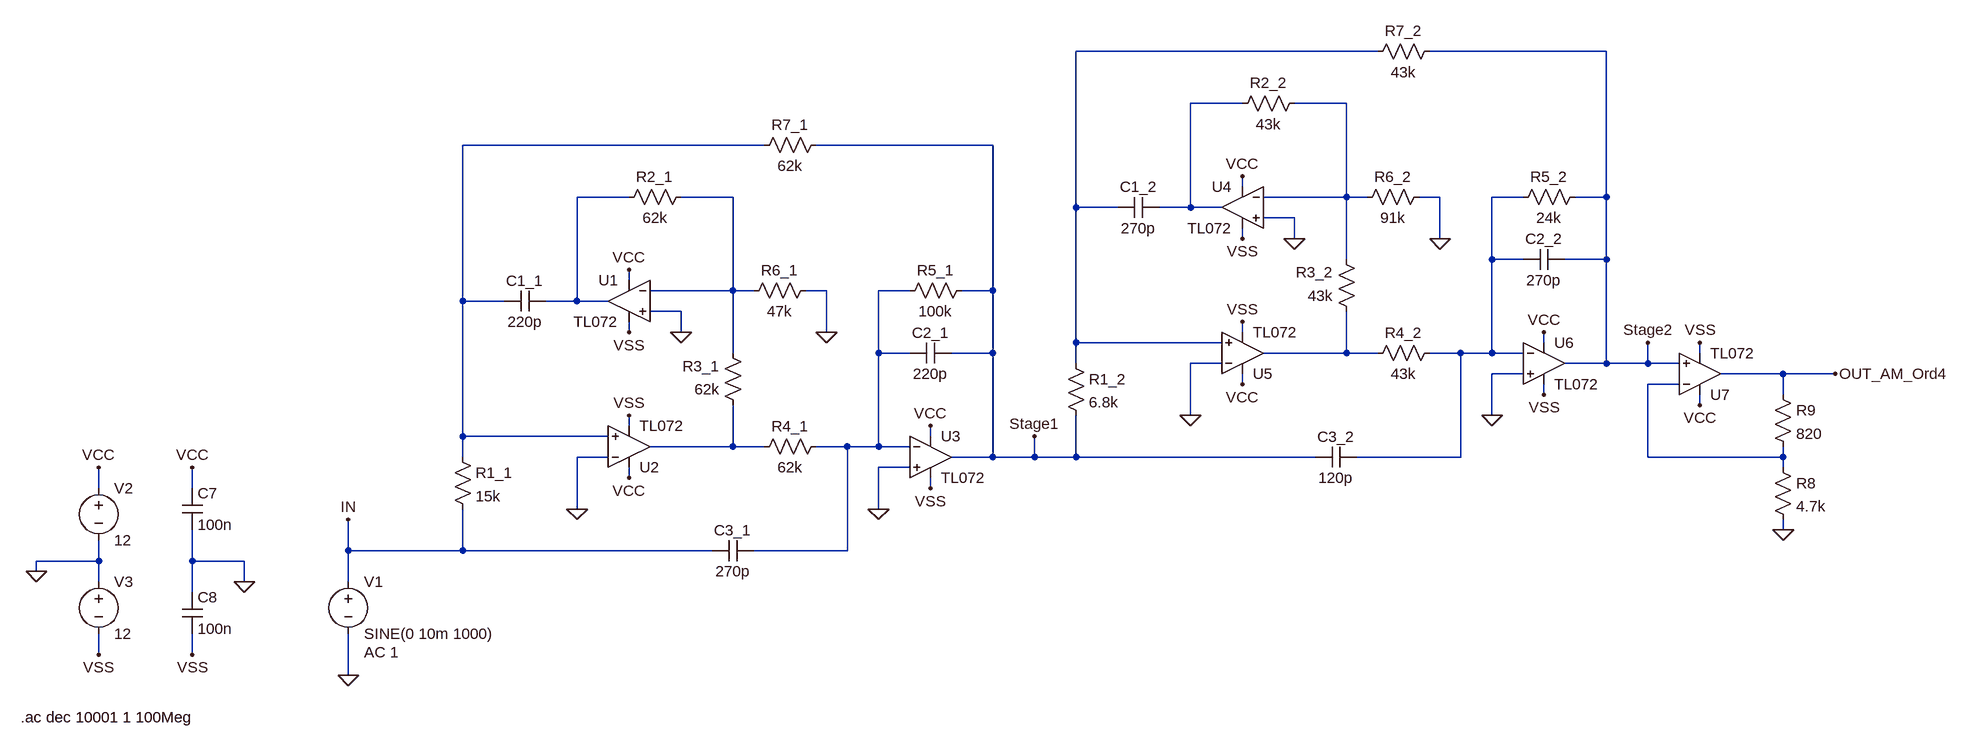
[diagram p0: schematic AM_ordnung4_10kHz_1dB_30dB_inv_cheby.asc]
AM_ordnung4_10kHz_1dB_30dB_inv_cheby.asc, the LTspice schematic file:
Version 4
SHEET 1 2500 736
WIRE 1360 -480 896 -480
WIRE 1712 -480 1440 -480
WIRE 1152 -400 1072 -400
WIRE 1312 -400 1232 -400
WIRE 416 -336 -48 -336
WIRE 768 -336 496 -336
WIRE 1152 -272 1152 -288
WIRE 208 -256 128 -256
WIRE 368 -256 288 -256
WIRE 1312 -256 1312 -400
WIRE 1312 -256 1184 -256
WIRE 1344 -256 1312 -256
WIRE 1456 -256 1424 -256
WIRE 1584 -256 1536 -256
WIRE 1712 -256 1712 -480
WIRE 1712 -256 1664 -256
WIRE 896 -240 896 -480
WIRE 960 -240 896 -240
WIRE 1072 -240 1072 -400
WIRE 1072 -240 1024 -240
WIRE 1120 -240 1072 -240
WIRE 1232 -224 1184 -224
WIRE 1152 -192 1152 -208
WIRE 1232 -192 1232 -224
WIRE 1456 -192 1456 -256
WIRE 1312 -160 1312 -256
WIRE 1536 -160 1536 -256
WIRE 1584 -160 1536 -160
WIRE 1712 -160 1712 -256
WIRE 1712 -160 1648 -160
WIRE 208 -128 208 -144
WIRE 368 -112 368 -256
WIRE 368 -112 240 -112
WIRE 400 -112 368 -112
WIRE 512 -112 480 -112
WIRE 640 -112 592 -112
WIRE 768 -112 768 -336
WIRE 768 -112 720 -112
WIRE -48 -96 -48 -336
WIRE 16 -96 -48 -96
WIRE 128 -96 128 -256
WIRE 128 -96 80 -96
WIRE 176 -96 128 -96
WIRE 288 -80 240 -80
WIRE 208 -48 208 -64
WIRE 288 -48 288 -80
WIRE 512 -48 512 -112
WIRE 1152 -48 1152 -64
WIRE 896 -32 896 -240
WIRE 1120 -32 896 -32
WIRE 1616 -32 1616 -48
WIRE 368 -16 368 -112
WIRE 592 -16 592 -112
WIRE 640 -16 592 -16
WIRE 768 -16 768 -112
WIRE 768 -16 704 -16
WIRE 1312 -16 1312 -80
WIRE 1312 -16 1184 -16
WIRE 1360 -16 1312 -16
WIRE 1488 -16 1440 -16
WIRE 1536 -16 1536 -160
WIRE 1536 -16 1488 -16
WIRE 1584 -16 1536 -16
WIRE 1856 -16 1856 -32
WIRE 896 0 896 -32
WIRE 1120 0 1072 0
WIRE 1712 0 1712 -160
WIRE 1712 0 1648 0
WIRE 1776 0 1776 -32
WIRE 1776 0 1712 0
WIRE 1824 0 1776 0
WIRE 1584 16 1536 16
WIRE 1984 16 1888 16
WIRE 2064 16 1984 16
WIRE 1152 32 1152 16
WIRE 1824 32 1776 32
WIRE 1616 48 1616 32
WIRE 1984 48 1984 16
WIRE 1856 64 1856 48
WIRE 1072 80 1072 0
WIRE 1536 80 1536 16
WIRE 208 96 208 80
WIRE -48 112 -48 -96
WIRE 176 112 -48 112
WIRE 672 112 672 96
WIRE 368 128 368 64
WIRE 368 128 240 128
WIRE 416 128 368 128
WIRE 544 128 496 128
WIRE 592 128 592 -16
WIRE 592 128 544 128
WIRE 640 128 592 128
WIRE -48 144 -48 112
WIRE 176 144 128 144
WIRE 768 144 768 -16
WIRE 768 144 704 144
WIRE 832 144 832 112
WIRE 832 144 768 144
WIRE 896 144 896 80
WIRE 896 144 832 144
WIRE 1264 144 896 144
WIRE 1488 144 1488 -16
WIRE 1488 144 1328 144
WIRE 1776 144 1776 32
WIRE 1984 144 1984 128
WIRE 1984 144 1776 144
WIRE 640 160 592 160
WIRE 1984 160 1984 144
WIRE 208 176 208 160
WIRE -608 192 -608 160
WIRE -464 192 -464 160
WIRE 672 192 672 176
WIRE 128 224 128 144
WIRE 592 224 592 160
WIRE 1984 256 1984 240
WIRE -224 288 -224 240
WIRE -48 288 -48 224
WIRE -48 288 -224 288
WIRE 336 288 -48 288
WIRE 544 288 544 128
WIRE 544 288 400 288
WIRE -608 304 -608 272
WIRE -608 304 -704 304
WIRE -464 304 -464 256
WIRE -384 304 -464 304
WIRE -704 320 -704 304
WIRE -608 336 -608 304
WIRE -384 336 -384 304
WIRE -224 336 -224 288
WIRE -464 352 -464 304
WIRE -608 448 -608 416
WIRE -464 448 -464 416
WIRE -224 480 -224 416
FLAG -608 160 VCC
FLAG -608 448 VSS
FLAG -704 320 0
FLAG -464 160 VCC
FLAG -464 448 VSS
FLAG -384 336 0
FLAG -224 480 0
FLAG -224 240 IN
FLAG 208 80 VSS
FLAG 208 -48 VSS
FLAG 672 192 VSS
FLAG 208 -144 VCC
FLAG 208 176 VCC
FLAG 672 96 VCC
FLAG 592 224 0
FLAG 128 224 0
FLAG 288 -48 0
FLAG 512 -48 0
FLAG 832 112 Stage1
FLAG 1152 -64 VSS
FLAG 1152 -192 VSS
FLAG 1616 48 VSS
FLAG 1152 -288 VCC
FLAG 1152 32 VCC
FLAG 1616 -48 VCC
FLAG 1536 80 0
FLAG 1072 80 0
FLAG 1232 -192 0
FLAG 1456 -192 0
FLAG 1984 256 0
FLAG 1856 -32 VSS
FLAG 1856 64 VCC
FLAG 2064 16 OUT_AM_Ord4
FLAG 1776 -32 Stage2
SYMBOL voltage -224 320 R0
WINDOW 123 24 124 Left 2
WINDOW 39 0 0 Left 0
SYMATTR Value2 AC 1
SYMATTR InstName V1
SYMATTR Value SINE(0 10m 1000)
SYMBOL voltage -608 176 R0
WINDOW 123 0 0 Left 0
WINDOW 39 0 0 Left 0
SYMATTR InstName V2
SYMATTR Value 12
SYMBOL voltage -608 320 R0
WINDOW 123 0 0 Left 0
WINDOW 39 0 0 Left 0
SYMATTR InstName V3
SYMATTR Value 12
SYMBOL cap -480 192 R0
SYMATTR InstName C7
SYMATTR Value 100n
SYMBOL cap -480 352 R0
SYMATTR InstName C8
SYMATTR Value 100n
SYMBOL TL072 208 -160 M0
SYMATTR InstName U1
SYMBOL TL072 208 192 M180
SYMATTR InstName U2
SYMBOL TL072 672 80 R0
SYMATTR InstName U3
SYMBOL res -64 128 R0
SYMATTR InstName R1_1
SYMATTR Value 15k
SYMBOL res 304 -272 R90
WINDOW 0 0 56 VBottom 2
WINDOW 3 32 56 VTop 2
SYMATTR InstName R2_1
SYMATTR Value 62k
SYMBOL res 384 80 R180
WINDOW 0 36 76 Left 2
WINDOW 3 36 40 Left 2
SYMATTR InstName R3_1
SYMATTR Value 62k
SYMBOL res 400 144 R270
WINDOW 0 32 56 VTop 2
WINDOW 3 0 56 VBottom 2
SYMATTR InstName R4_1
SYMATTR Value 62k
SYMBOL res 624 -96 R270
WINDOW 0 32 56 VTop 2
WINDOW 3 0 56 VBottom 2
SYMATTR InstName R5_1
SYMATTR Value 100k
SYMBOL res 384 -96 R270
WINDOW 0 32 56 VTop 2
WINDOW 3 0 56 VBottom 2
SYMATTR InstName R6_1
SYMATTR Value 47k
SYMBOL res 400 -320 R270
WINDOW 0 32 56 VTop 2
WINDOW 3 0 56 VBottom 2
SYMATTR InstName R7_1
SYMATTR Value 62k
SYMBOL cap 80 -112 R90
WINDOW 0 0 32 VBottom 2
WINDOW 3 32 32 VTop 2
SYMATTR InstName C1_1
SYMATTR Value 220p
SYMBOL cap 704 -32 R90
WINDOW 0 0 32 VBottom 2
WINDOW 3 32 32 VTop 2
SYMATTR InstName C2_1
SYMATTR Value 220p
SYMBOL cap 400 272 R90
WINDOW 0 0 32 VBottom 2
WINDOW 3 32 32 VTop 2
SYMATTR InstName C3_1
SYMATTR Value 270p
SYMBOL TL072 1152 -304 M0
SYMATTR InstName U4
SYMBOL TL072 1152 48 M180
SYMATTR InstName U5
SYMBOL TL072 1616 -64 R0
SYMATTR InstName U6
SYMBOL res 880 -16 R0
SYMATTR InstName R1_2
SYMATTR Value 6.8k
SYMBOL res 1248 -416 R90
WINDOW 0 0 56 VBottom 2
WINDOW 3 32 56 VTop 2
SYMATTR InstName R2_2
SYMATTR Value 43k
SYMBOL res 1328 -64 R180
WINDOW 0 36 76 Left 2
WINDOW 3 36 40 Left 2
SYMATTR InstName R3_2
SYMATTR Value 43k
SYMBOL res 1344 0 R270
WINDOW 0 32 56 VTop 2
WINDOW 3 0 56 VBottom 2
SYMATTR InstName R4_2
SYMATTR Value 43k
SYMBOL res 1568 -240 R270
WINDOW 0 32 56 VTop 2
WINDOW 3 0 56 VBottom 2
SYMATTR InstName R5_2
SYMATTR Value 24k
SYMBOL res 1328 -240 R270
WINDOW 0 32 56 VTop 2
WINDOW 3 0 56 VBottom 2
SYMATTR InstName R6_2
SYMATTR Value 91k
SYMBOL res 1344 -464 R270
WINDOW 0 32 56 VTop 2
WINDOW 3 0 56 VBottom 2
SYMATTR InstName R7_2
SYMATTR Value 43k
SYMBOL cap 1024 -256 R90
WINDOW 0 0 32 VBottom 2
WINDOW 3 32 32 VTop 2
SYMATTR InstName C1_2
SYMATTR Value 270p
SYMBOL cap 1648 -176 R90
WINDOW 0 0 32 VBottom 2
WINDOW 3 32 32 VTop 2
SYMATTR InstName C2_2
SYMATTR Value 270p
SYMBOL cap 1328 128 R90
WINDOW 0 0 32 VBottom 2
WINDOW 3 32 32 VTop 2
SYMATTR InstName C3_2
SYMATTR Value 120p
SYMBOL res 1968 144 R0
SYMATTR InstName R8
SYMATTR Value 4.7k
SYMBOL res 1968 32 R0
SYMATTR InstName R9
SYMATTR Value 820
SYMBOL TL072 1856 80 M180
SYMATTR InstName U7
TEXT -728 544 Left 2 !.ac dec 10001 1 100Meg

The netlist it stands for:
* AM_ordnung4_10kHz_1dB_30dB_inv_cheby.asc
V1 IN 0 SINE(0 10m 1000) AC 1
V2 VCC 0 12
V3 0 VSS 12
C7 VCC 0 100n
C8 0 VSS 100n
* U1: TL072 (symbol TL072 not available, pins judged from their places): In+=0 In-=N006 V+=VCC V-=VSS OUT=N005
* U2: TL072 (symbol TL072 not available, pins judged from their places): In+=N004 In-=0 V+=VCC V-=VSS OUT=N011
* U3: TL072 (symbol TL072 not available, pins judged from their places): In+=0 In-=N008 V+=VCC V-=VSS OUT=Stage1
R1_1 N004 IN 15k
R2_1 N006 N005 62k
R3_1 N011 N006 62k
R4_1 N011 N008 62k
R5_1 N008 Stage1 100k
R6_1 N006 0 47k
R7_1 N004 Stage1 62k
C1_1 N005 N004 220p
C2_1 Stage1 N008 220p
C3_1 N008 IN 270p
* U4: TL072 (symbol TL072 not available, pins judged from their places): In+=0 In-=N003 V+=VCC V-=VSS OUT=N002
* U5: TL072 (symbol TL072 not available, pins judged from their places): In+=N001 In-=0 V+=VCC V-=VSS OUT=N009
* U6: TL072 (symbol TL072 not available, pins judged from their places): In+=0 In-=N007 V+=VCC V-=VSS OUT=Stage2
R1_2 N001 Stage1 6.8k
R2_2 N003 N002 43k
R3_2 N009 N003 43k
R4_2 N009 N007 43k
R5_2 N007 Stage2 24k
R6_2 N003 0 91k
R7_2 N001 Stage2 43k
C1_2 N002 N001 270p
C2_2 Stage2 N007 270p
C3_2 N007 Stage1 120p
R8 N010 0 4.7k
R9 OUT_AM_Ord4 N010 820
* U7: TL072 (symbol TL072 not available, pins judged from their places): In+=Stage2 In-=N010 V+=VCC V-=VSS OUT=OUT_AM_Ord4
.ac dec 10001 1 100Meg
.backanno
.end